# Altium schematic sheet Digital clock schematic.SchDoc: Digital Clock
size A; Author: Group 16; CompanyName: Truong Dai Hoc Bach Khoa TPHCM; Engineer: Group 16; SheetNumber: 1; SheetTotal: 1; Parameter 1: 1
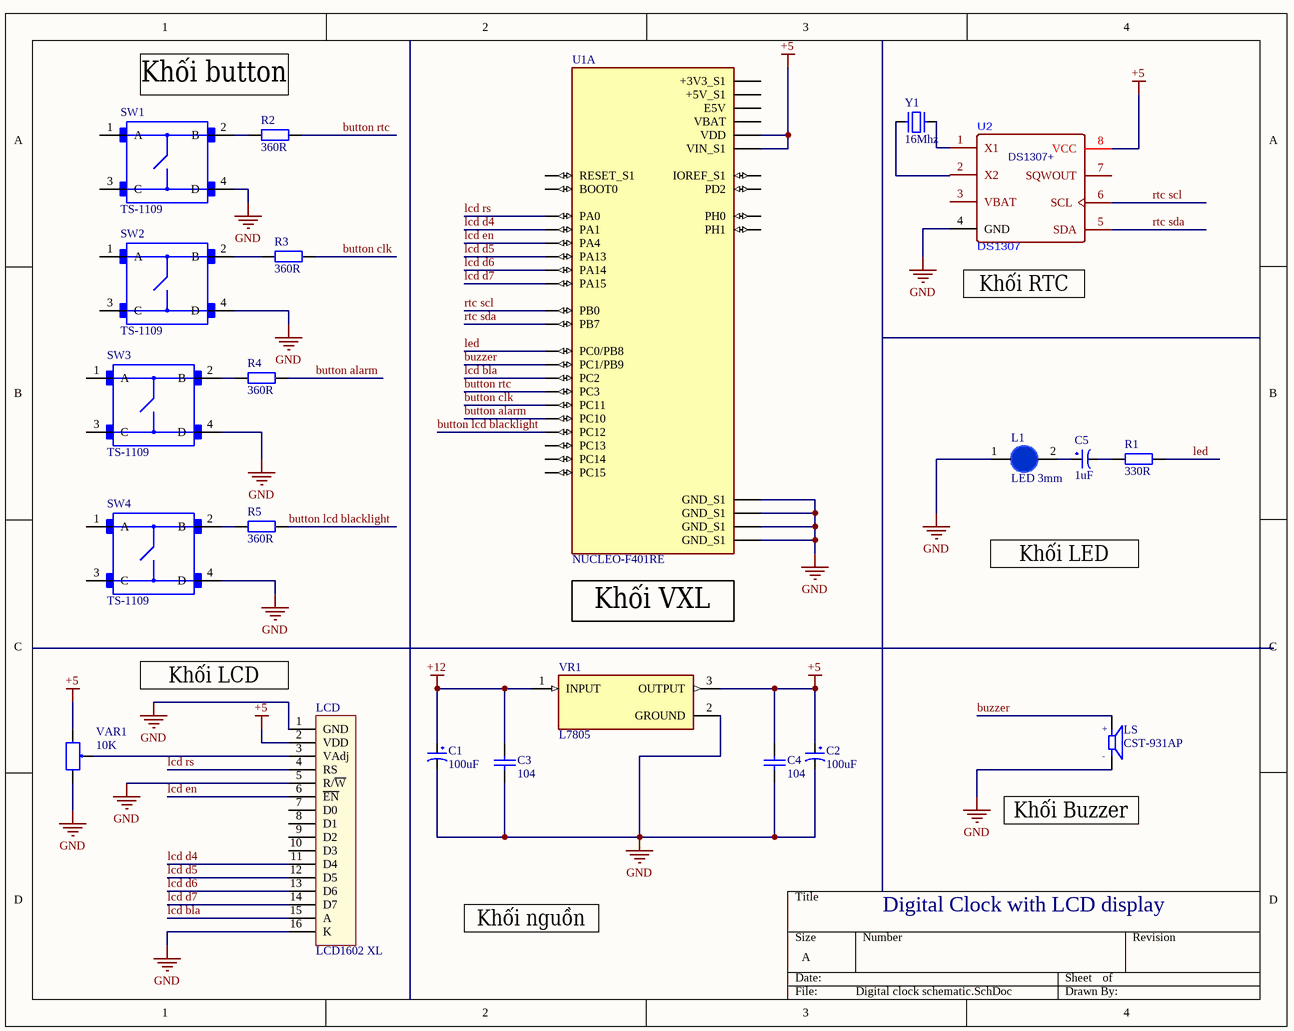
[diagram p0: Digital clock schematic.SchDoc]

## Parts
C1  100uF  [tu hoa 5mm]
C2  100uF  [tu hoa 5mm]
C3  104  [tu 0603]
C4  104  [tu 0603]
C5  1uF  [tu hoa 5mm]
L1  LED 3mm  [LED-3MM-BLUE]
LCD  LCD1602 XL  [LCD1602 with Jump]
LS  CST-931AP  [CUI_CST-931AP]
R1  330R  [tro vach 1/4w]
R2  360R  [tro vach 1/4w]
R3  360R  [tro vach 1/4w]
R4  360R  [tro vach 1/4w]
R5  360R  [tro vach 1/4w]
SW1  TS-1109  [SW_TS-1109]
SW2  TS-1109  [SW_TS-1109]
SW3  TS-1109  [SW_TS-1109]
SW4  TS-1109  [SW_TS-1109]
U1  NUCLEO-F401RE  [ST_NUCLEO-F401RE]  (part A of 6)
U2  DS1307  [SOP 8]
VAR1  10K  [BIEN TRO VI CHINH NAM]
VR1  L7805  [TO255P1020X450X2000-3]
Y1  16Mhz  [Thach Anh 2 Chan 32,768 KHz]

## Nets
+5: C2.1 C4.2 LCD.2(VDD) U1.CN7_5(VDD) U1.CN7_24(VIN_S1) U2.8(VCC) VAR1.1 VR1.3(OUTPUT)
+12: C1.1 C3.2 VR1.1(INPUT)
GND: C1.2 C2.2 C3.1 C4.1 L1.1(A) LCD.1(GND) LCD.5(R/~{W}) LCD.16(K) LS.M SW1.4(D) SW2.4(D) SW3.4(D) SW4.4(D) U1.CN7_8(GND_S1) U1.CN7_19(GND_S1) U1.CN7_20(GND_S1) U1.CN7_22(GND_S1) U2.4(GND) VAR1.3 VR1.2(GROUND)
button alarm: R4.2 U1.CN7_1(PC10)
button clk: R3.2 U1.CN7_2(PC11)
button lcd blacklight: R5.2 U1.CN7_3(PC12)
button rtc: R2.2 U1.CN7_37(PC3)
buzzer: LS.P U1.CN7_36(PC1/PB9)
lcd bla: LCD.15(A) U1.CN7_35(PC2)
lcd d4: LCD.11(D4) U1.CN7_30(PA1)
lcd d5: LCD.12(D5) U1.CN7_13(PA13)
lcd d6: LCD.13(D6) U1.CN7_15(PA14)
lcd d7: LCD.14(D7) U1.CN7_17(PA15)
lcd en: LCD.6(~{EN}) U1.CN7_32(PA4)
lcd rs: LCD.4(RS) U1.CN7_28(PA0)
led: R1.2 U1.CN7_38(PC0/PB8)
rtc scl: U1.CN7_34(PB0) U2.6(SCL)
rtc sda: U1.CN7_21(PB7) U2.5(SDA)
NetC5_1: C5.1 L1.2(K)
NetC5_2: C5.2 R1.1
NetLCD_3: LCD.3(VAdj) VAR1.2
NetR2_1: R2.1 SW1.2(B)
NetR3_1: R3.1 SW2.2(B)
NetR4_1: R4.1 SW3.2(B)
NetR5_1: R5.1 SW4.2(B)
NetU2_1: U2.1(X1) Y1.2

Not connected (* = marked no-connect by the designer): LCD 7(D0) 8(D1) 9(D2) 10(D3); SW1 1(A) 3(C); SW2 1(A) 3(C); SW3 1(A) 3(C); SW4 1(A) 3(C); U1 CN7_4(PD2) CN7_6(E5V) CN7_7(BOOT0) CN7_12(IOREF_S1) CN7_14(RESET_S1) CN7_16(+3V3_S1) CN7_18(+5V_S1) CN7_23(PC13) CN7_25(PC14) CN7_27(PC15) CN7_29(PH0) CN7_31(PH1) CN7_33(VBAT); U2 2(X2) 3(VBAT) 7(SQWOUT); Y1 1

## Notes on the sheet
- Khối button
- (near U2) Khối RTC
- Khối LED
- (near U1) Khối VXL
- (near LCD) Khối LCD
- (near LS) Khối Buzzer
- Digital Clock with LCD display
- Khối nguồn
- (in symbol CST-931AP) +; -
- (in symbol DS1307) DS1307+

## Library data of the parts
C1 = Tu Hoa 100uF 25V 6x11: Cắm; Don_Vi: Con; So_Chan: 2; Ten_Linh_Kien: Tụ Hóa 100uF 25V 6x11MM; Ma_Hang: MH001351; Chung_Loai: Cắm; Kieu_Chan: *
C2 = Tu Hoa 100uF 16V 5x7: Cắm; Don_Vi: Con; So_Chan: 2; Ten_Linh_Kien: Tụ Hóa 100uF 16V 5x7MM; Ma_Hang: MH001347; Chung_Loai: Cắm; Kieu_Chan: *
C3 C4 = Tu 0603 104 50V 10%: Dán; Don_Vi: Con; So_Chan: 2; Ten_Linh_Kien: Tụ 0603 104-100nF 10% 50V; Ma_Hang: MH004568; Chung_Loai: Dán; Kieu_Chan: *
C5 = Tu Hoa 1uF 400V 6x10: Cắm; Don_Vi: Con; So_Chan: 2; Ten_Linh_Kien: Tụ Hóa 1uF 400V 6x10MM; Ma_Hang: MH003742; Chung_Loai: Cắm; Kieu_Chan: *
L1 = LED 3mm Xanh Duong: Cắm; Don_Vi: Con; Ma_Hang: MH009003; Ten_Linh_Kien: LED 3MM Xanh Dương SS (1000c); Ghi_Chu: *; Kieu_Chan: *; Chung_Loai: Cắm
LCD = LCD1602 XL: LCD 1602 Xanh Lá; Ten: Màn hình LCD 1602 Xanh Lá; Ma_Hang: 67HZ; NCC: NSHOP; CHIP: HD44780
LS = CST-931AP: 9 mm, 3 V, 85 dB, Through Hole, Magnetic Audio Transducer Buzzer; MF: CUI Devices; Price: None; Availability: Unavailable; Package: CUI Inc.; CUI_purchase_URL: https://www.cuidevices.com/product/audio/buzzers/audio-transducers/cst-931ap?utm_source=snapeda.com&utm_medium=referral&utm_campaign=snapedaBOM; MP: CST-931AP; Value: *; SnapEDA_Link: https://www.snapeda.com/parts/CST-931AP/CUI%20Devices/view-part/1551284/?ref=snap
R1 = Tro Vach 1/4W 1% 330R: Cắm; Don_Vi: Con; So_Chan: 2; Ten_Linh_Kien: Trở Vạch 1/4w 1% 330R; Ma_Hang: MH006348; Chung_Loai: Cắm; Kieu_Chan: *
R2-R5 = Tro Vach 1/4W 1% 360R: Cắm; Don_Vi: Con; So_Chan: 2; Ten_Linh_Kien: Trở Vạch 1/4W 1% 360R; Ma_Hang: MH008835; Chung_Loai: Cắm; Kieu_Chan: *
SW1-SW4 = TS-1109: Heat Sink Full Brick DC/DC Converter Aluminum Top Mount; MF: Samtec Inc.; MP: TS-1109; Price: None; Availability: Unavailable; SnapEDA_Link: https://www.snapeda.com/parts/TS-1109/Samtec%20Inc./view-part/106451/?ref=snap; Value: *; Package: None
U1 = NUCLEO-F401RE: STM32 Nucleo-64 development board with STM32F401RET6 MCU, supports Arduino and ST morpho connectivity; Availability: Unavailable; Price: None; Package: None; MP: NUCLEO-F401RE; Value: *
U2 = DS1307: C5145427
VAR1 = Bien Tro Tinh Chinh 100R Nam: Cắm; Don_Vi: Con; Ten_Linh_Kien: Biến Trở VR 101-100R 3296W; Ma_Hang: MH003235; Kieu_Chan: *; Chung_Loai: Cắm
VR1 = L7805: Standard Regulator Pos 5V 1.5A 3-Pin(3+Tab) TO-220FP Tube; MF: STMicroelectronics; MP: L7805; Value: *; SnapEDA_Link: https://www.snapeda.com/parts/L7805/STMicroelectronics/view-part/?ref=snap; Price: None; Package: None; Check_prices: https://www.snapeda.com/parts/L7805/STMicroelectronics/view-part/?ref=eda; Availability: Not in stock
Y1 = Thach Anh 2 chan 32,768 Khz: Crystal For all Crystal 2pin.; Value: 4Mhz